# EAGLE design candycane-r1 (EAGLE 5.12)
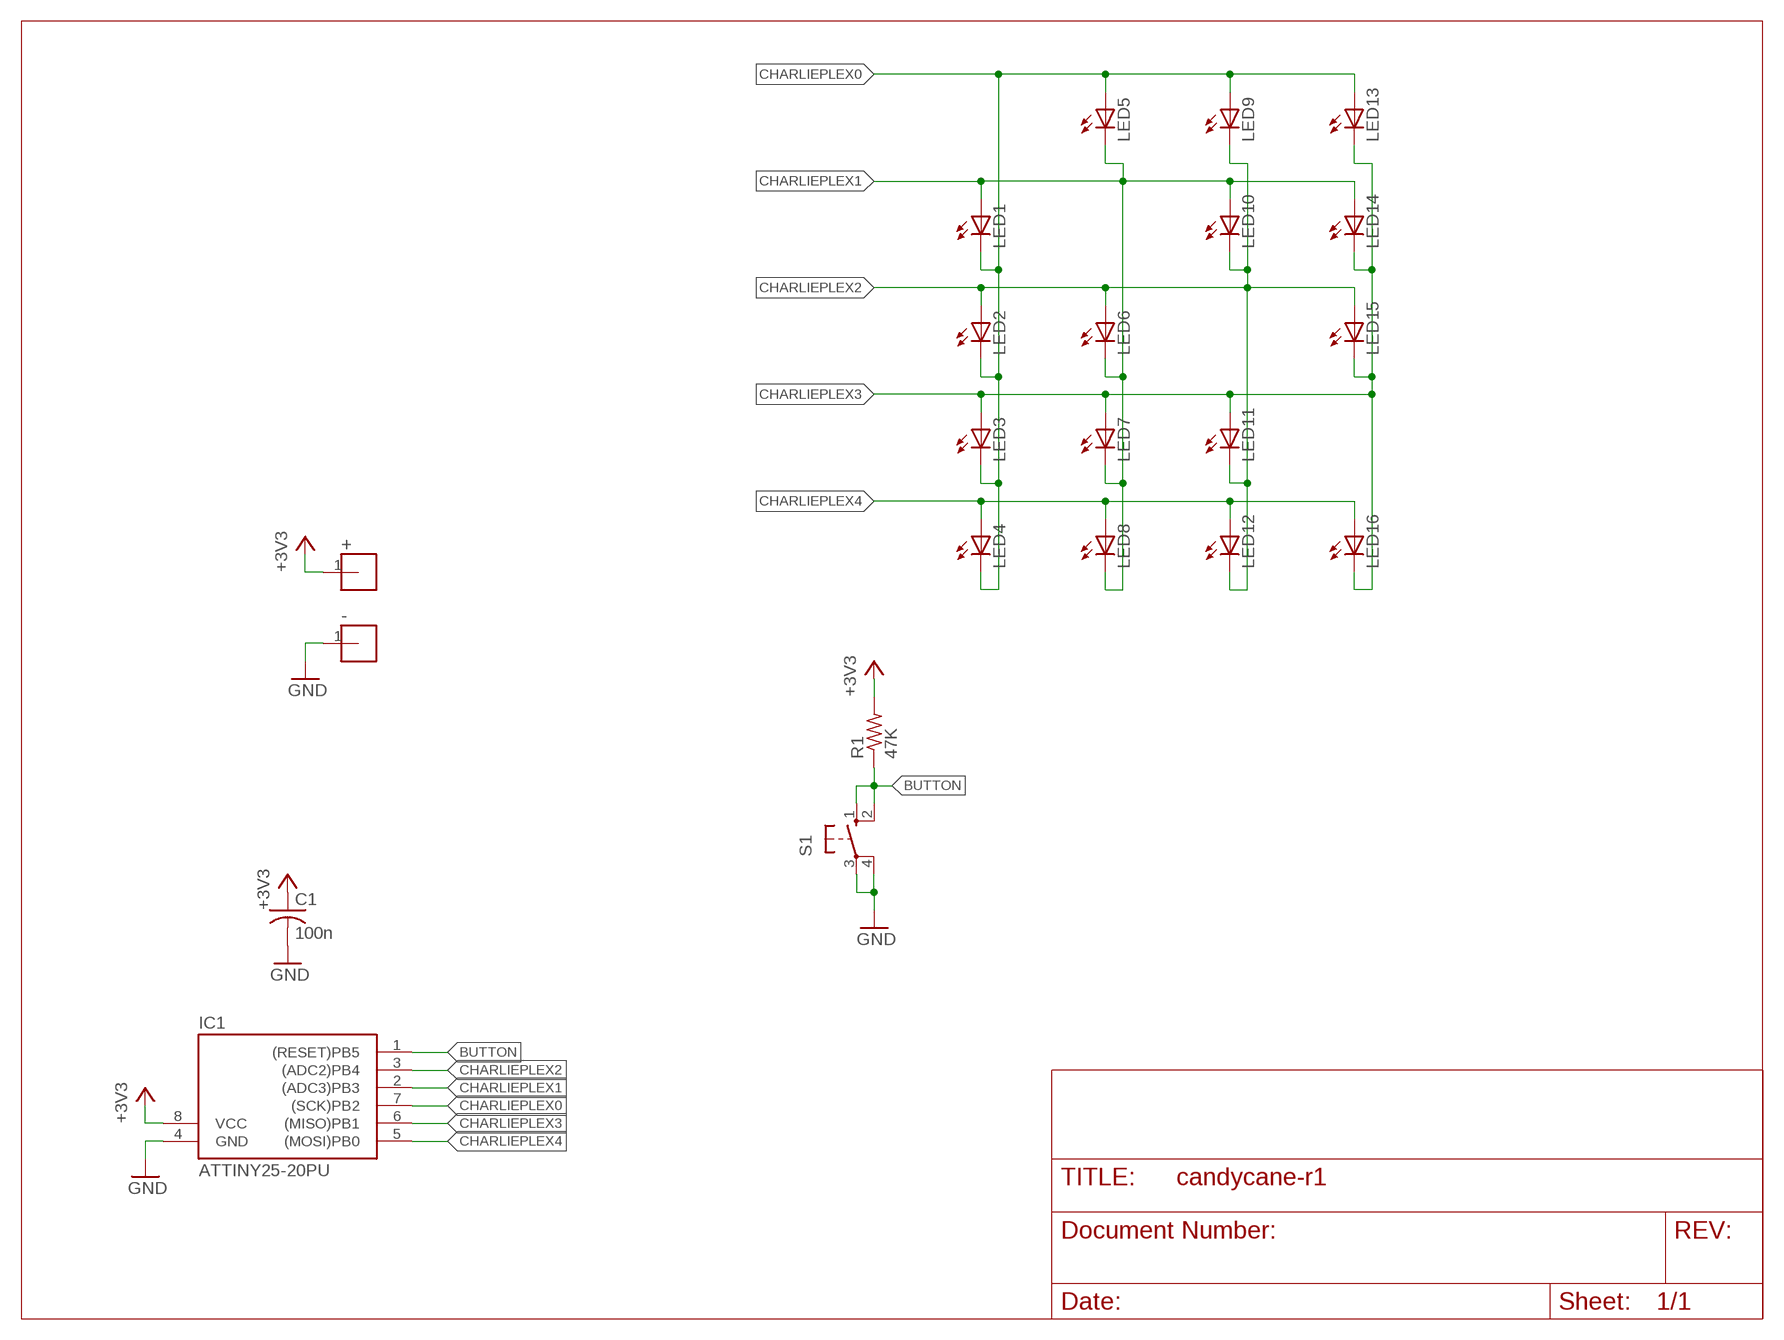
[diagram p0: schematic, sheet 1]

## Parts
+  M01-100MIL  [100MIL-1]
-  M01-100MIL  [100MIL-1]
C1  100n  C-US050-025X075  [C050-025X075]
IC1  ATTINY25-20PU  TINY138P3  [DIL08]
LED1  LED3MM  [LED3MM]
LED2  LED3MM  [LED3MM]
LED3  LED3MM  [LED3MM]
LED4  LED3MM  [LED3MM]
LED5  LED3MM  [LED3MM]
LED6  LED3MM  [LED3MM]
LED7  LED3MM  [LED3MM]
LED8  LED3MM  [LED3MM]
LED9  LED3MM  [LED3MM]
LED10  LED3MM  [LED3MM]
LED11  LED3MM  [LED3MM]
LED12  LED3MM  [LED3MM]
LED13  LED3MM  [LED3MM]
LED14  LED3MM  [LED3MM]
LED15  LED3MM  [LED3MM]
LED16  LED3MM  [LED3MM]
R1  47K  R-US_0207/10  [0207/10]
S1  10-XX  [B3F-10XX]

## Nets
+3V3: +.1 C1.1 IC1.8(VCC) R1.2
BUTTON: IC1.1((RESET)PB5) R1.1 S1.1(S) S1.2(S1)
CHARLIEPLEX0: IC1.7((SCK)PB2) LED1.K(C) LED2.K(C) LED3.K(C) LED4.K(C) LED5.A LED9.A LED13.A
CHARLIEPLEX1: IC1.2((ADC3)PB3) LED1.A LED5.K(C) LED6.K(C) LED7.K(C) LED8.K(C) LED10.A LED14.A
CHARLIEPLEX2: IC1.3((ADC2)PB4) LED2.A LED6.A LED9.K(C) LED10.K(C) LED11.K(C) LED12.K(C) LED15.A
CHARLIEPLEX3: IC1.6((MISO)PB1) LED3.A LED7.A LED11.A LED13.K(C) LED14.K(C) LED15.K(C) LED16.K(C)
CHARLIEPLEX4: IC1.5((MOSI)PB0) LED4.A LED8.A LED12.A LED16.A
GND: -.1 C1.2 IC1.4(GND) S1.3(P) S1.4(P1)

## Library data of the parts
+ - = rbg-generic-headers:M01-100MIL
C1 = rcl:C-US: CAPACITOR, American symbol
IC1 = avr-5:TINY13*
LED1-LED16 = led:LED: LED OSRAM: - CHIPLED LG R971, LG N971, LY N971, LG Q971, LY Q971, LO R971, LY R971 LH N974, LH R974 LS Q976, LO Q976, LY Q976 LO Q996 - Hyper CHIPLED LW Q18S LB Q993, LB Q99A, LB R99A - SideLED LS A670, LO A670, LY A670, LG A670, LP A670 LB A673, LV A673, LT A673, LW A673 LH A674 LY A675 LS A676, LA A676, LO A676, LY A676, LW A676 LS A679, LY A679, LG A679 - Hyper Micro SIDELED® LS Y876, LA Y876, LO Y876, LY Y876 LT Y87S - SmartLED LW L88C, LW L88S LB L89C, LB L89S, LG L890 LS L89K, LO L89K, LY L89K LS L896, LA L896, LO L896, LY L896 - TOPLED LS T670, LO T670, LY T670, LG T670, LP T670 LSG T670, LSP T670, LSY T670, LOP T670, LYG T670 LG T671, LOG T671, LSG T671 LB T673, LV T673, LT T673, LW T673 LH T674 LS T676, LA T676, LO T676, LY T676, LB T676, LH T676, LSB T676, LW T676 LB T67C, LV T67C, LT T67C, LS T67K, LO T67K, LY T67K, LW E67C LS E67B, LA E67B, LO E67B, LY E67B, LB E67C, LV E67C, LT E67C LW T67C LS T679, LY T679, LG T679 LS T770, LO T770, LY T770, LG T770, LP T770 LB T773, LV T773, LT T773, LW T773 LH T774 LS E675, LA E675, LY E675, LS T675 LS T776, LA T776, LO T776, LY T776, LB T776 LHGB T686 LT T68C, LB T68C - Hyper Mini TOPLED® LB M676 - Mini TOPLED Santana® LG M470 LS M47K, LO M47K, LY M47K Source: http://www.osram.convergy.de LUXEON: - LUMILED® LXK2-PW12-R00, LXK2-PW12-S00, LXK2-PW14-U00, LXK2-PW14-V00 LXK2-PM12-R00, LXK2-PM12-S00, LXK2-PM14-U00 LXK2-PE12-Q00, LXK2-PE12-R00, LXK2-PE12-S00, LXK2-PE14-T00, LXK2-PE14-U00 LXK2-PB12-K00, LXK2-PB12-L00, LXK2-PB12-M00, LXK2-PB14-N00, LXK2-PB14-P00, LXK2-PB14-Q00 LXK2-PR12-L00, LXK2-PR12-M00, LXK2-PR14-Q00, LXK2-PR14-R00 LXK2-PD12-Q00, LXK2-PD12-R00, LXK2-PD12-S00 LXK2-PH12-R00, LXK2-PH12-S00 LXK2-PL12-P00, LXK2-PL12-Q00, LXK2-PL12-R00 Source: www.luxeon.com KINGBRIGHT: KA-3528ASYC Source: www.kingbright.com
R1 = rcl:R-US_: RESISTOR, American symbol
S1 = rbg-generic-tact-switch:10-XX: OMRON SWITCH

## Board
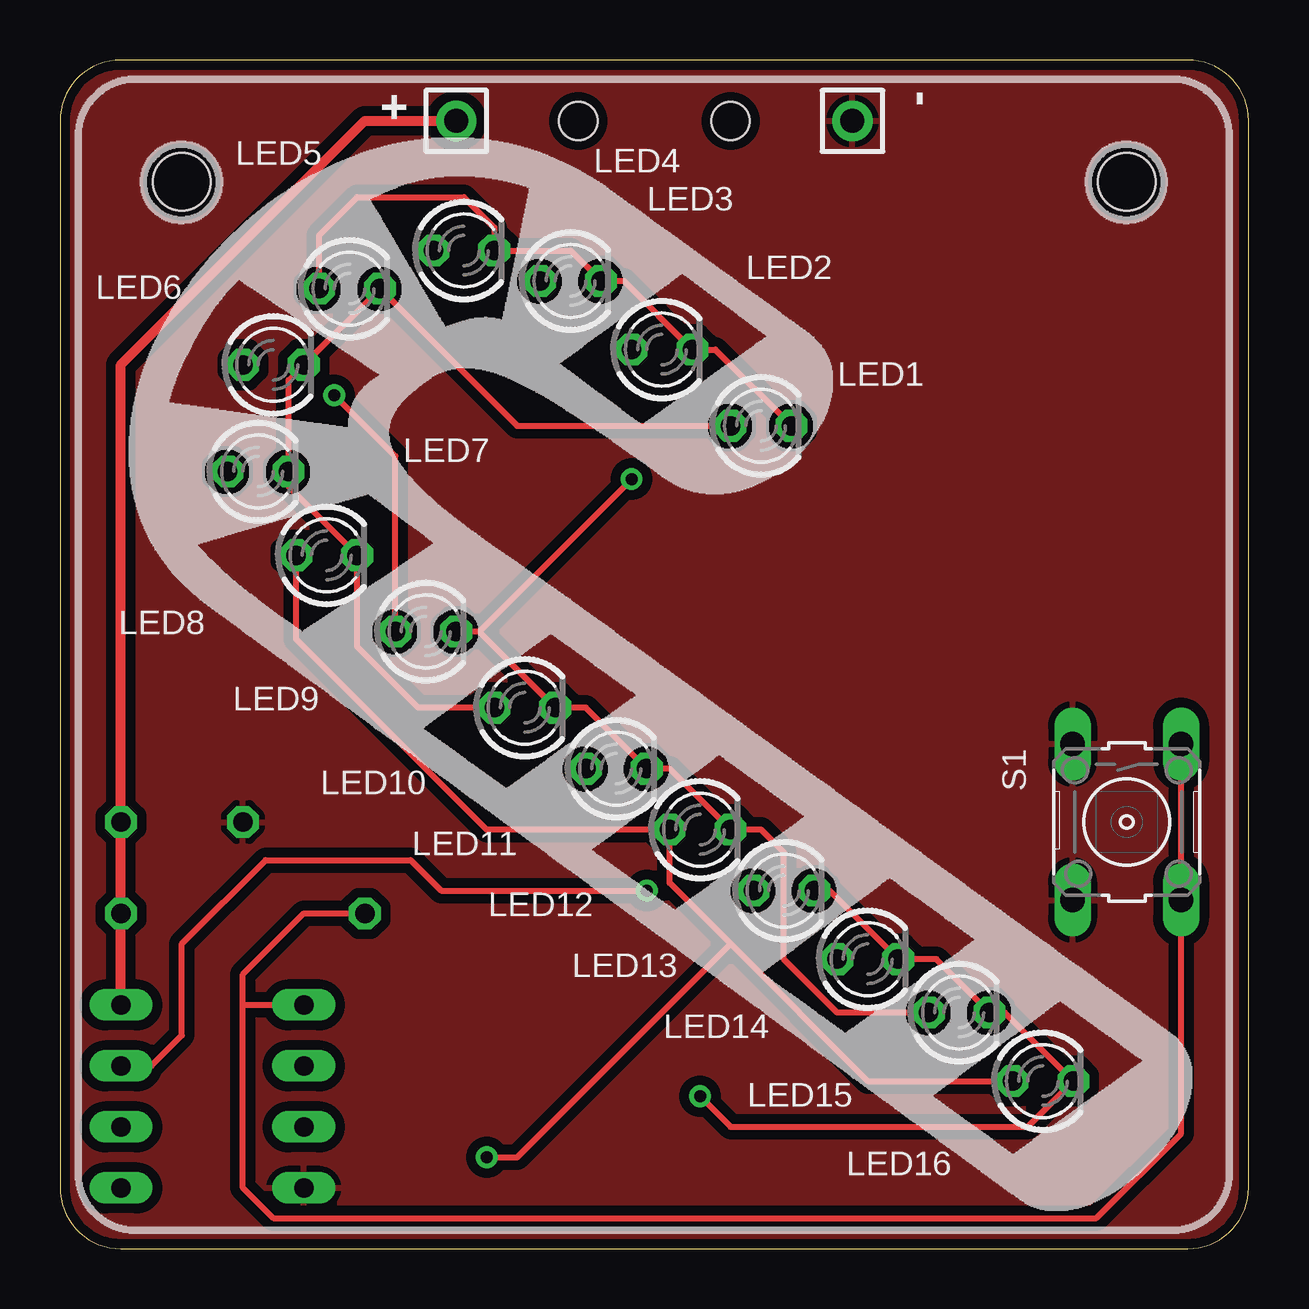
[diagram p1: board, top side]
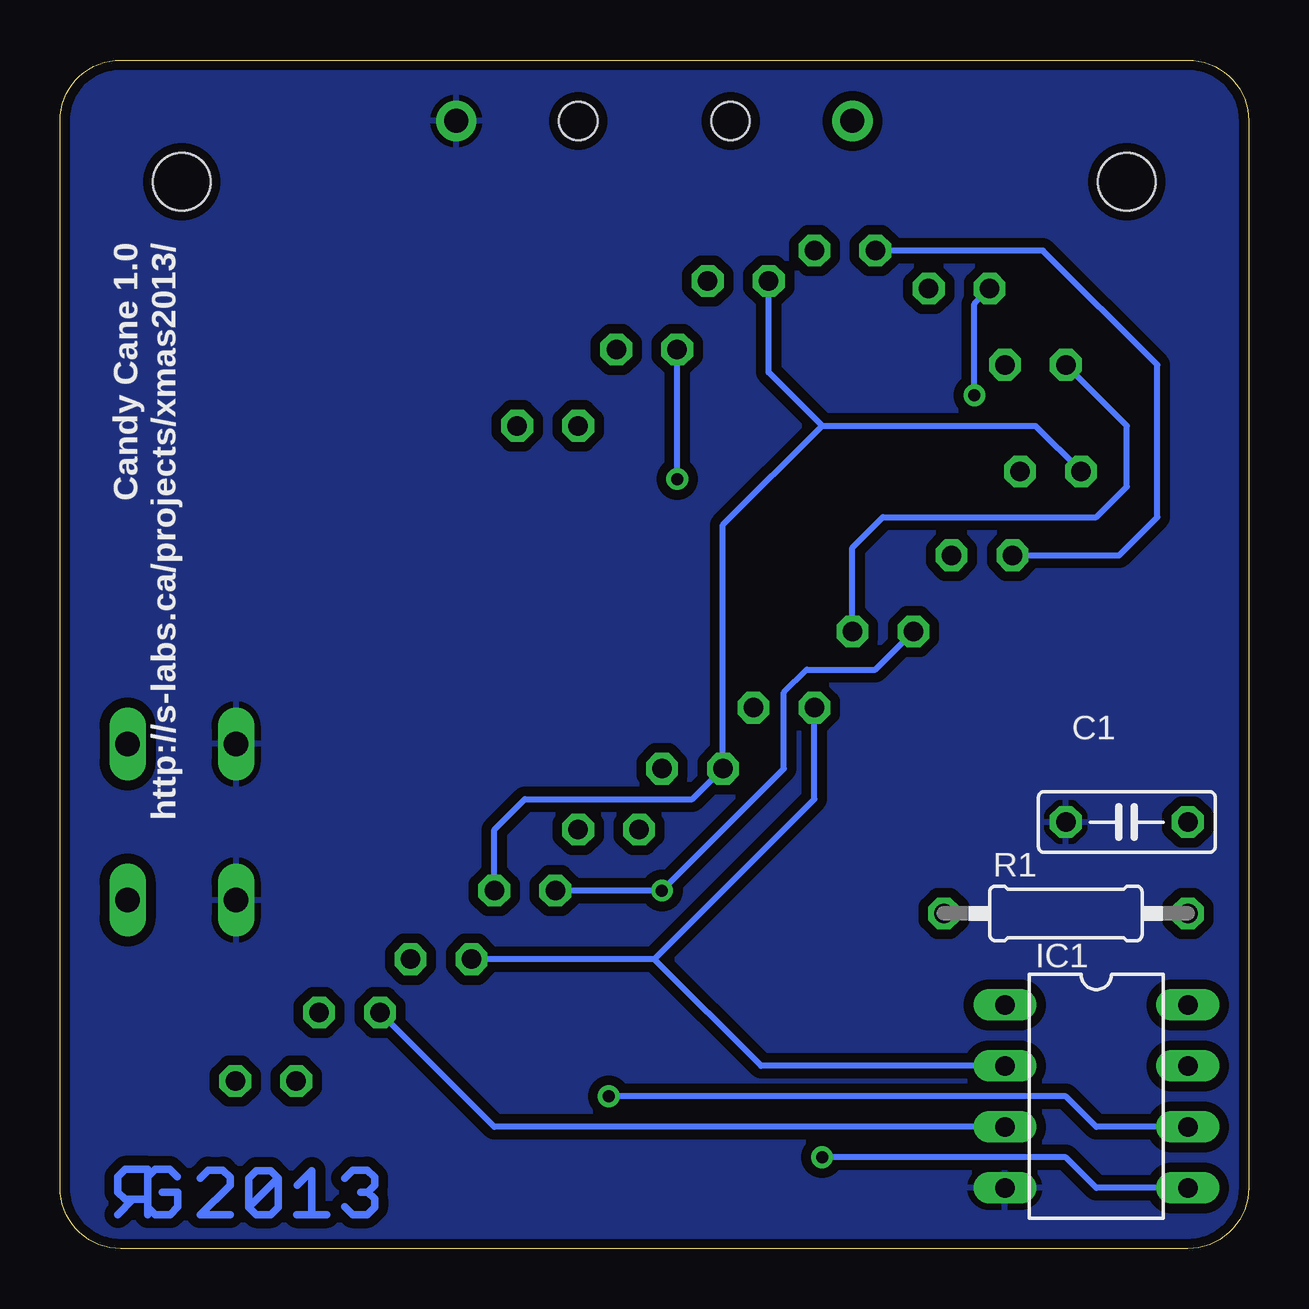
[diagram p2: board, bottom side, seen from below]

Size 49.53 x 49.53 mm. Coordinates in mm from the lower left corner, seen from the top.
Outline: 46.99,0 arc90 49.53,2.54 49.53,46.99 arc90 46.99,49.53 2.54,49.53 arc90 0,46.99 0,2.54 arc90 2.54,0 46.99,0
Copper layers (1*16): Top 0.035mm / dielectric 1.5mm / Bottom 0.035mm
Design rules "default *": minimum track width 10mil, minimum drill 0.5mm, track to track 8mil, track to pad 8mil, pad to pad 8mil, via to via 8mil, smd to smd 8mil, copper to edge 10mil, drill to drill 8mil, minimum pad ring 10mil, minimum via ring 8mil, stop-mask expansion 4mil, vias tented up to drill 20mil, thermal gap 10mil
Holes 2.4 mm at 5.08,44.45 44.45,44.45
Holes 1.6 mm at 21.59,46.99 27.94,46.99

### Footprints (pad centres in the part's own frame; a part is rotated, then mirrored left to right if it is on the bottom)
100MIL-1 = drill 1 pad 1.676 round: 1 0,0
C050-025X075 = drill 0.813 octagon: 1 -2.54,0; 2 2.54,0
DIL08 = drill 0.813 long: 1 -3.81,-3.81; 2 -1.27,-3.81; 3 1.27,-3.81; 4 3.81,-3.81; 5 3.81,3.81; 6 1.27,3.81; 7 -1.27,3.81; 8 -3.81,3.81
LED3MM = drill 0.813 octagon: A -1.27,0; K 1.27,0
0207/10 = drill 0.813 octagon: 1 -5.08,0; 2 5.08,0
B3F-10XX = drill 1.016 long: 1 -3.251,2.261; 2 3.251,2.261; 3 -3.251,-2.261; 4 3.251,-2.261

### Placement (x,y rotation side)
+  16.51,46.99 90 top
-  33.02,46.99 270 top
C1  5.08,17.78 180 bottom
IC1  6.35,6.35 270 bottom
LED1  29.21,34.29 0 top
LED2  25.08,37.47 0 top
LED3  21.27,40.32 0 top
LED4  16.83,41.59 0 top
LED5  12.06,40.01 0 top
LED6  8.89,36.83 0 top
LED7  8.26,32.38 0 top
LED8  11.11,28.89 0 top
LED9  15.24,25.72 0 top
LED10  19.37,22.54 0 top
LED11  23.18,20 0 top
LED12  26.67,17.46 0 top
LED13  30.16,14.92 0 top
LED14  33.66,12.06 0 top
LED15  37.47,9.84 0 top
LED16  40.96,6.99 0 top
R1  7.62,13.97 0 bottom
S1  44.45,17.78 270 top
U$1  [CANDYCANE]  0.64,0.64 0 top
U$2  [RGLOGO_SMALL_2013]  45.72,1.27 0 bottom

### Tracks (layer width: path | path; a pad name or v marks a point on that pad's centre or on a via)
+3V3
  Top 0.406: IC1.8 R1.2 C1.1 2.54,36.83 12.7,46.99 +.1
BUTTON
  Top 0.254: S1.1 S1.2 46.71,4.8 43.18,1.27 8.89,1.27 7.62,2.54 7.62,10.16 | 7.62,10.16 7.62,11.43 10.16,13.97 R1.1 | 7.62,10.16 IC1.1
CHARLIEPLEX0  (via drill 0.5)
  Top 0.254: LED1.K 27.3,37.47 LED2.K 23.5,40.32 LED3.K 21.27,41.59 LED4.K 18.1,42.55 16.83,43.81 12.38,43.81 10.79,42.23 LED5.A | LED9.A 13.97,33.02 v11.43,35.56 | v24.45,14.92 15.88,14.92 14.61,16.19 8.57,16.19 5.08,12.7 5.08,8.89 3.81,7.62 IC1.7
  Bottom 0.254: LED13.A v24.45,14.92 19.37,20 19.37,23.18 18.41,24.13 15.56,24.13 LED9.A | v11.43,35.56 11.43,39.37 LED5.A
CHARLIEPLEX1
  Top 0.254: LED1.A 19.05,34.29 LED5.K LED6.K 9.53,36.2 LED7.K 9.53,31.75 LED8.K 12.38,25.08 14.92,22.54 LED10.A
  Bottom 0.254: 24.77,12.06 LED14.A | 24.77,12.06 18.1,18.73 LED10.A | IC1.2 20.32,7.62 24.77,12.06
CHARLIEPLEX2  (via drill 0.5)
  Top 0.254: 17.46,25.72 LED10.K 21.91,22.54 LED11.K 25.4,20 LED12.K 29.21,17.46 30.16,16.51 30.16,12.06 32.38,9.84 LED15.A | 17.46,25.72 LED9.K | 17.46,25.72 v23.81,32.07
  Bottom 0.254: v23.81,32.07 LED2.A | IC1.3 31.43,5.08 LED15.A | LED9.K 16.51,29.21 15.24,30.48 6.35,30.48 5.08,31.75 5.08,34.29 LED6.A
CHARLIEPLEX3  (via drill 0.5)
  Top 0.254: LED13.K 32.07,14.92 LED14.K 36.51,12.06 LED15.K 39.37,9.84 LED16.K 40.32,5.08 27.94,5.08 v26.67,6.35
  Bottom 0.254: LED13.K 31.43,17.46 30.16,18.73 23.18,18.73 LED11.A 21.91,30.16 17.78,34.29 | LED3.A 20,36.51 17.78,34.29 | 17.78,34.29 8.89,34.29 LED7.A | IC1.6 6.35,5.08 7.62,6.35 v26.67,6.35
CHARLIEPLEX4  (via drill 0.5)
  Top 0.254: LED16.A 33.66,6.99 27.94,12.7 | 27.94,12.7 25.4,15.24 LED12.A 17.78,17.46 9.84,25.4 LED8.A | v17.78,3.81 19.05,3.81 27.94,12.7
  Bottom 0.254: IC1.5 6.35,2.54 7.62,3.81 v17.78,3.81 | LED4.A 8.57,41.59 3.81,36.83 3.81,30.48 5.4,28.89 LED8.A
GND
  pour Top (isolate 0.406): -1.27,50.8 50.8,50.8 50.8,-1.27 -1.27,-1.27
  pour Bottom (isolate 0.406): -1.27,50.8 50.8,50.8 50.8,-1.27 -1.27,-1.27

### Text on the board
bPlace: http://s-labs.ca/projects/xmas2013/ | Candy Cane 1.0